# EAGLE design ALAYOUT (EAGLE 6.2)
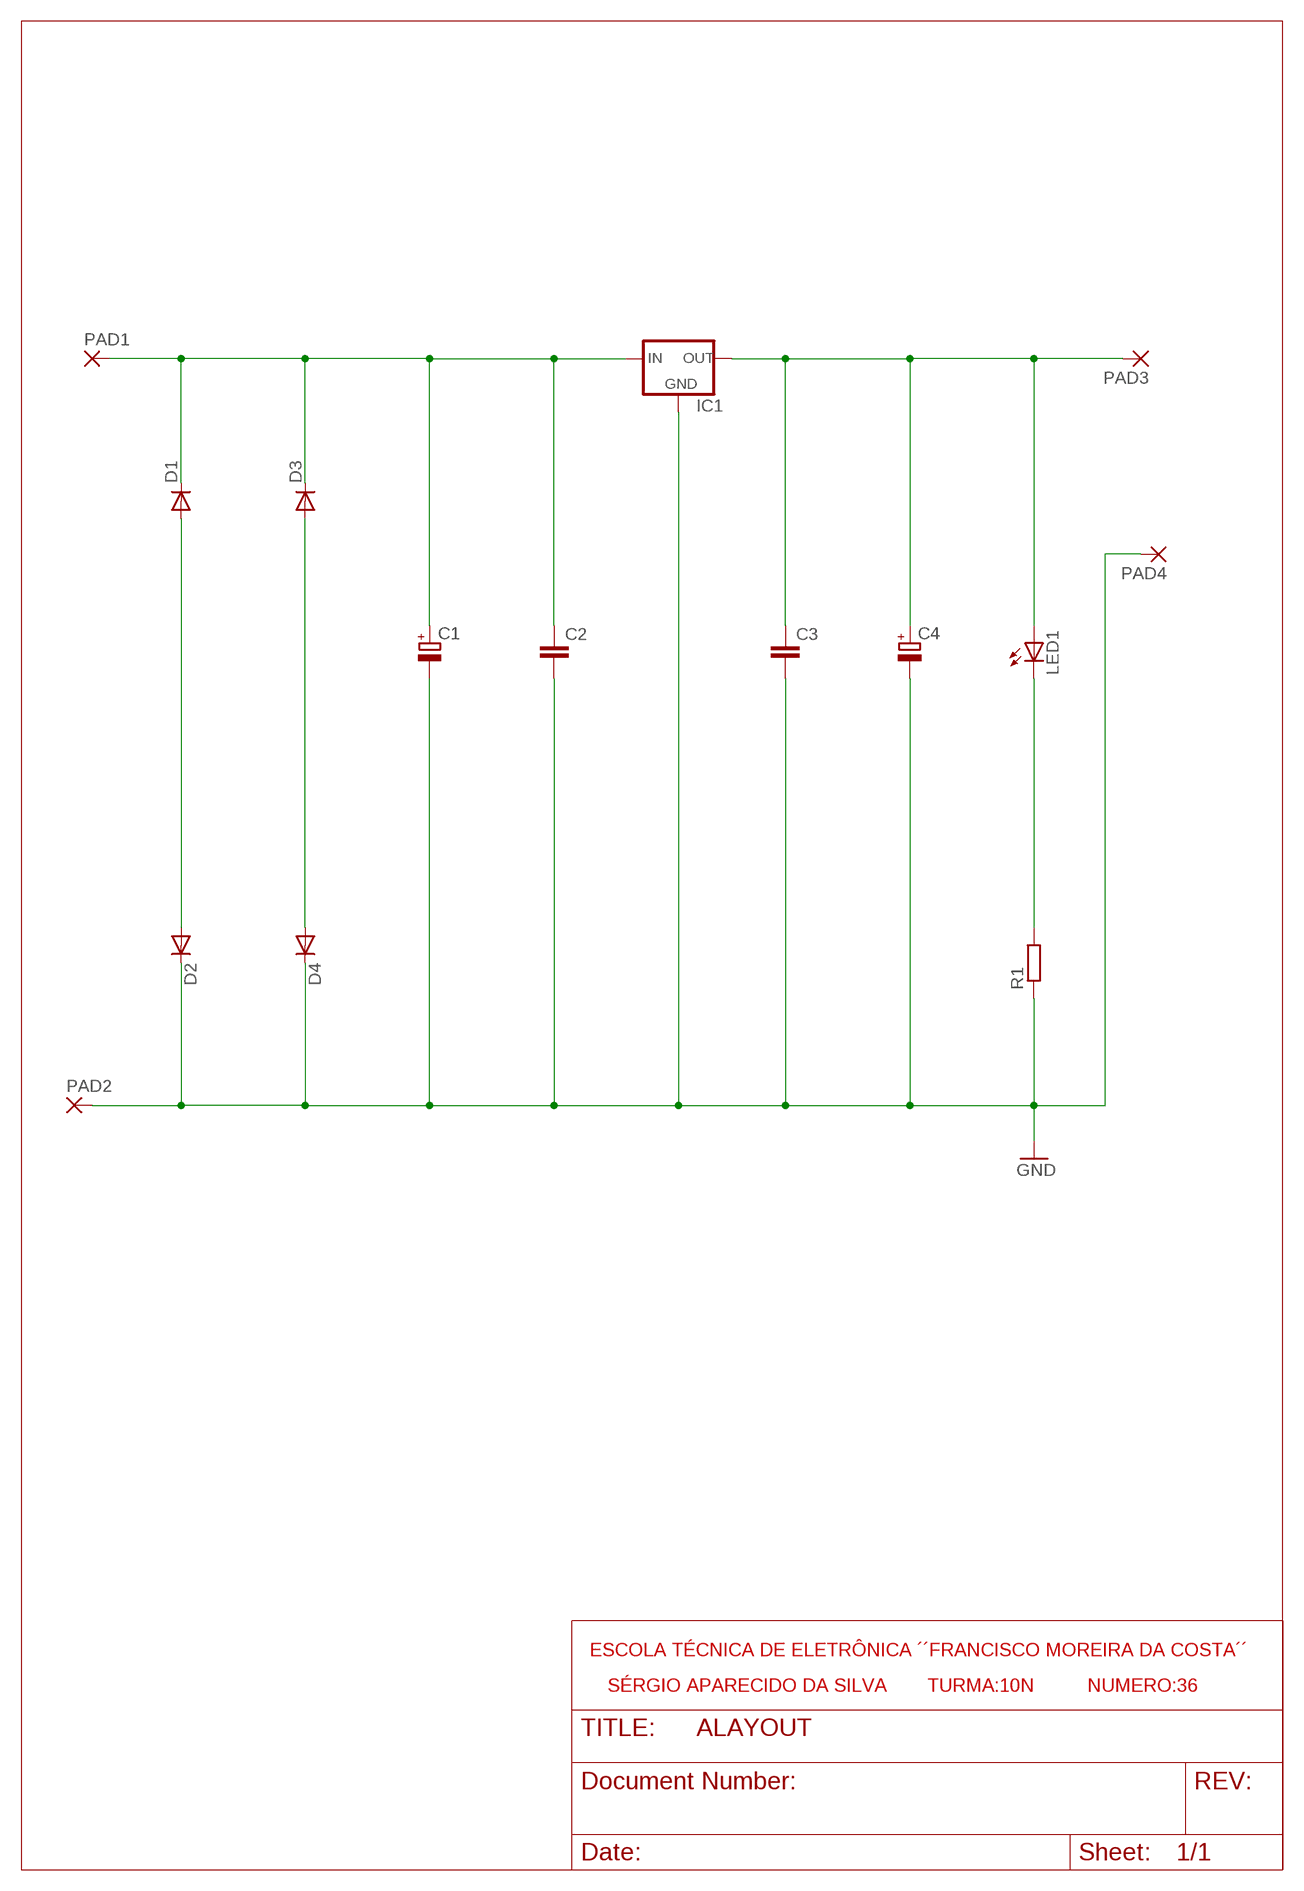
[diagram p0: schematic, sheet 1]

## Parts
C1  CPOL-EUE7.5-16  [E7,5-16]
C2  C-EU050-030X075  [C050-030X075]
C3  C-EU050-030X075  [C050-030X075]
C4  CPOL-EUE5-8.5  [E5-8,5]
D1  DIODE-DO35-10  [DO35-10]
D2  DIODE-DO35-10  [DO35-10]
D3  DIODE-DO35-10  [DO35-10]
D4  DIODE-DO35-10  [DO35-10]
IC1  78XXS  [78XXS]
LED1  LED3MM  [LED3MM]
PAD1  3,17/1,1  [3,17/1,1]
PAD2  3,17/1,1  [3,17/1,1]
PAD3  3,17/1,1  [3,17/1,1]
PAD4  3,17/1,1  [3,17/1,1]
R1  R-EU_0207/10  [0207/10]

## Nets
GND: C1.- C2.2 C3.2 C4.- D2.C D4.C IC1.GND PAD2.1(P) PAD4.1(P) R1.1
N$1: D3.A D4.A
N$2: C1.+ C2.1 D1.C D3.C IC1.IN PAD1.1(P)
N$3: D1.A D2.A
N$5: C3.1 C4.+ IC1.OUT LED1.A PAD3.1(P)
N$7: LED1.K(C) R1.2

## Notes on the sheet
- ESCOLA TÉCNICA DE ELETRÔNICA ´´FRANCISCO MOREIRA DA COSTA´´
- SÉRGIO APARECIDO DA SILVA | TURMA:10N | NUMERO:36

## Library data of the parts
C1 C4 = rcl:CPOL-EU: POLARIZED CAPACITOR, European symbol
C2 C3 = rcl:C-EU: CAPACITOR, European symbol
D1-D4 = diode:DIODE-: DIODE
IC1 = v-reg:78XXS: VOLTAGE REGULATOR
LED1 = led:LED: LED OSRAM: - CHIPLED LG R971, LG N971, LY N971, LG Q971, LY Q971, LO R971, LY R971 LH N974, LH R974 LS Q976, LO Q976, LY Q976 LO Q996 - Hyper CHIPLED LW Q18S LB Q993, LB Q99A, LB R99A - SideLED LS A670, LO A670, LY A670, LG A670, LP A670 LB A673, LV A673, LT A673, LW A673 LH A674 LY A675 LS A676, LA A676, LO A676, LY A676, LW A676 LS A679, LY A679, LG A679 - Hyper Micro SIDELED® LS Y876, LA Y876, LO Y876, LY Y876 LT Y87S - SmartLED LW L88C, LW L88S LB L89C, LB L89S, LG L890 LS L89K, LO L89K, LY L89K LS L896, LA L896, LO L896, LY L896 - TOPLED LS T670, LO T670, LY T670, LG T670, LP T670 LSG T670, LSP T670, LSY T670, LOP T670, LYG T670 LG T671, LOG T671, LSG T671 LB T673, LV T673, LT T673, LW T673 LH T674 LS T676, LA T676, LO T676, LY T676, LB T676, LH T676, LSB T676, LW T676 LB T67C, LV T67C, LT T67C, LS T67K, LO T67K, LY T67K, LW E67C LS E67B, LA E67B, LO E67B, LY E67B, LB E67C, LV E67C, LT E67C LW T67C LS T679, LY T679, LG T679 LS T770, LO T770, LY T770, LG T770, LP T770 LB T773, LV T773, LT T773, LW T773 LH T774 LS E675, LA E675, LY E675, LS T675 LS T776, LA T776, LO T776, LY T776, LB T776 LHGB T686 LT T68C, LB T68C - Hyper Mini TOPLED® LB M676 - Mini TOPLED Santana® LG M470 LS M47K, LO M47K, LY M47K Source: http://www.osram.convergy.de LUXEON: - LUMILED® LXK2-PW12-R00, LXK2-PW12-S00, LXK2-PW14-U00, LXK2-PW14-V00 LXK2-PM12-R00, LXK2-PM12-S00, LXK2-PM14-U00 LXK2-PE12-Q00, LXK2-PE12-R00, LXK2-PE12-S00, LXK2-PE14-T00, LXK2-PE14-U00 LXK2-PB12-K00, LXK2-PB12-L00, LXK2-PB12-M00, LXK2-PB14-N00, LXK2-PB14-P00, LXK2-PB14-Q00 LXK2-PR12-L00, LXK2-PR12-M00, LXK2-PR14-Q00, LXK2-PR14-R00 LXK2-PD12-Q00, LXK2-PD12-R00, LXK2-PD12-S00 LXK2-PH12-R00, LXK2-PH12-S00 LXK2-PL12-P00, LXK2-PL12-Q00, LXK2-PL12-R00 Source: www.luxeon.com KINGBRIGHT: KA-3528ASYC Source: www.kingbright.com
PAD1-PAD4 = wirepad:3,17/1,1: THROUGH-HOLE PAD
R1 = rcl:R-EU_: RESISTOR, European symbol

## Board
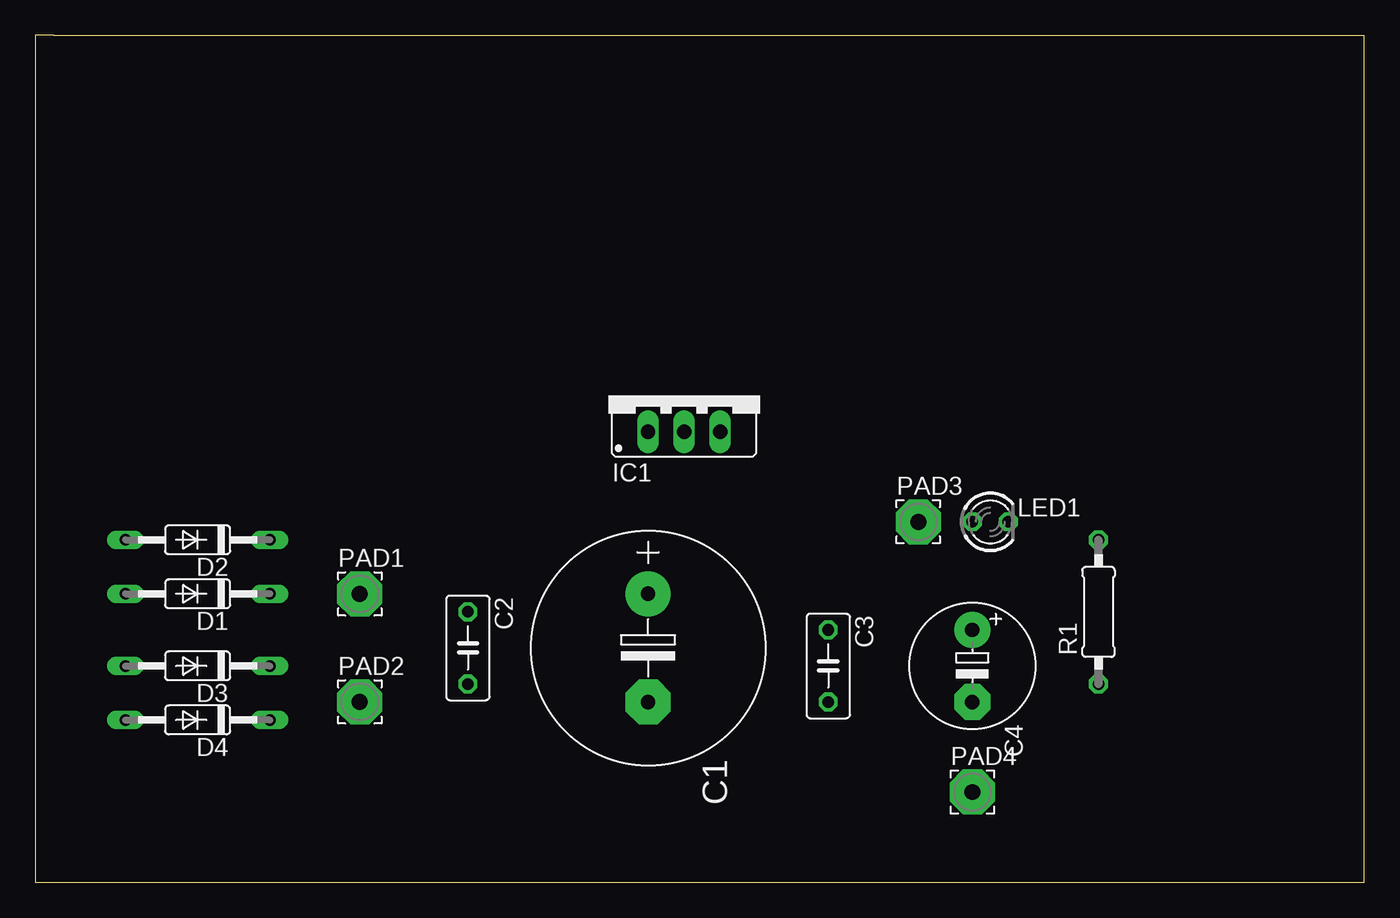
[diagram p1: board, top side]
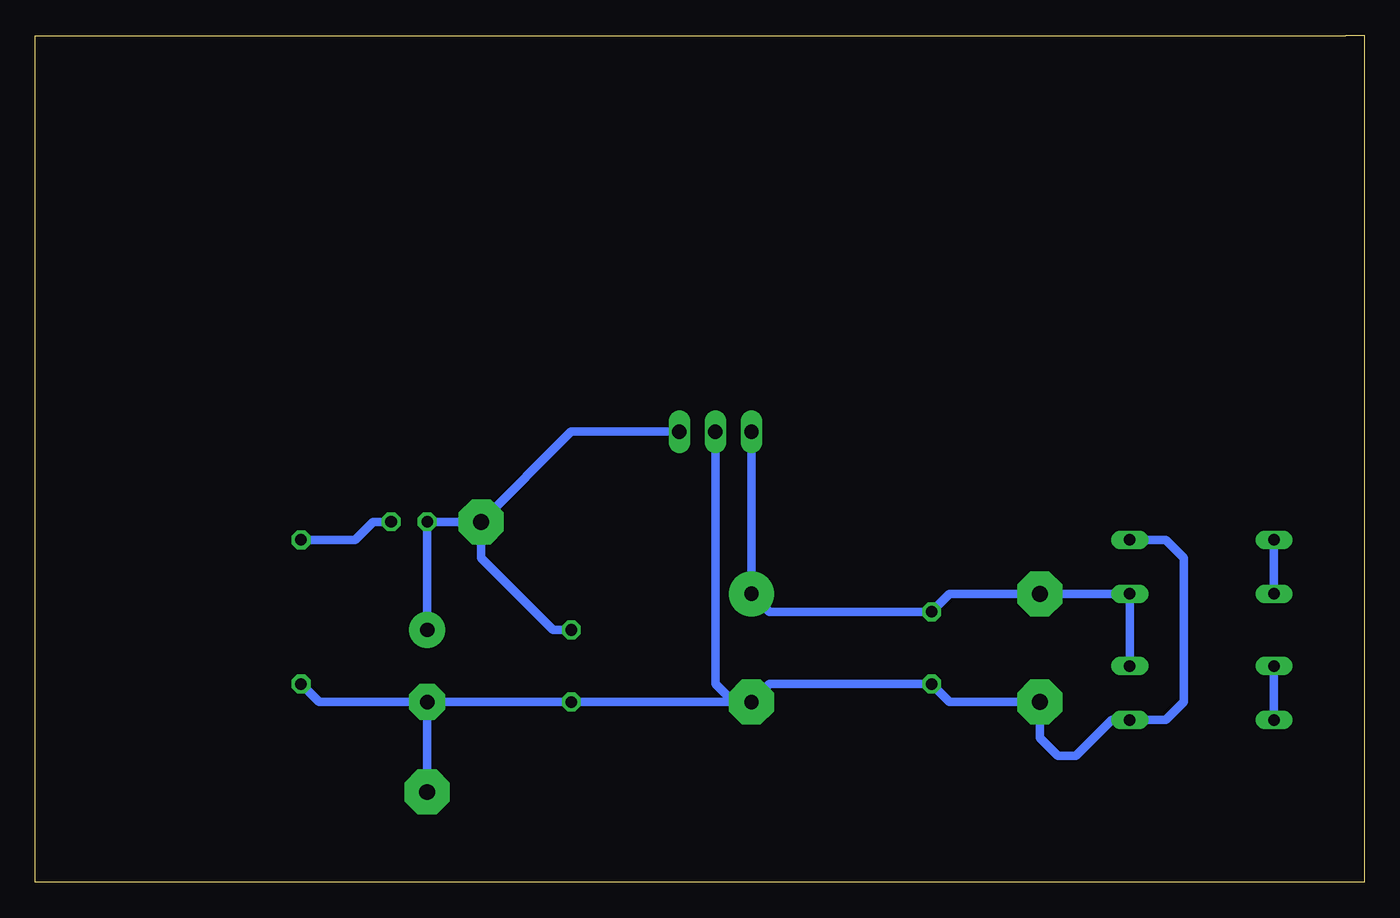
[diagram p2: board, bottom side, seen from below]

Size 93.65 x 59.69 mm. Coordinates in mm from the lower left corner, seen from the top.
Outline: 1.27,59.68 93.65,59.68 93.65,0 0,0 0,59.69 1.27,59.69
Copper layers (1*16): Top 0.035mm / dielectric 1.5mm / Bottom 0.035mm
Design rules: minimum track width 10mil, minimum drill 24mil, track to track 8mil, track to pad 8mil, pad to pad 8mil, via to via 8mil, smd to smd 8mil, copper to edge 40mil, drill to drill 8mil, minimum pad ring 10mil, minimum via ring 8mil, stop-mask expansion 4mil, vias tented up to drill 0mil, thermal gap 10mil

### Footprints (pad centres in the part's own frame; a part is rotated, then mirrored left to right if it is on the bottom)
E7,5-16 = drill 1.016 pad 3.15: + -3.81,0 | drill 1.016 pad 3.15 octagon: - 3.81,0
C050-030X075 = drill 0.813 octagon: 1 -2.54,0; 2 2.54,0
E5-8,5 = drill 1.016 pad 2.54: + -2.54,0 | drill 1.016 pad 2.54 octagon: - 2.54,0
DO35-10 = drill 0.813 long: A 5.08,0; C -5.08,0
78XXS = drill 1.016 long: GND 0,-2.54; IN -2.54,-2.54; OUT 2.54,-2.54
LED3MM = drill 0.813 octagon: A -1.27,0; K 1.27,0
3,17/1,1 = drill 1.118 pad 3.175 octagon: 1 0,0
0207/10 = drill 0.813 octagon: 1 -5.08,0; 2 5.08,0

### Placement (x,y rotation side)
C1  43.18,16.51 270 top
C2  30.48,16.51 270 top
C3  55.88,15.24 270 top
C4  66.04,15.24 270 top
D1  11.43,20.32 180 top
D2  11.43,24.13 180 top
D3  11.43,15.24 180 top
D4  11.43,11.43 180 top
IC1  45.72,34.29 0 top
LED1  67.31,25.4 0 top
PAD1  22.86,20.32 0 top
PAD2  22.86,12.7 0 top
PAD3  62.23,25.4 0 top
PAD4  66.04,6.35 0 top
R1  74.93,19.05 90 top

### Tracks (layer width: path | path; a pad name or v marks a point on that pad's centre or on a via)
GND
  Bottom 0.61: D2.C 13.97,24.13 12.7,22.86 12.7,12.7 13.97,11.43 D4.C 17.78,11.43 20.32,8.89 21.59,8.89 22.86,10.16 PAD2.1 29.21,12.7 C2.2 41.91,13.97 C1.- | IC1.GND 45.72,13.97 44.45,12.7 C1.- | C1.- C3.2 C4.- | C4.- PAD4.1 | C4.- 73.66,12.7 R1.1
N$1
  Bottom 0.61: D4.A D3.A
N$2
  Bottom 0.61: D3.C D1.C PAD1.1 29.21,20.32 C2.1 41.91,19.05 C1.+ IC1.IN
N$3
  Bottom 0.61: D2.A D1.A
N$5
  Bottom 0.61: IC1.OUT 55.88,31.75 PAD3.1 | C3.1 57.15,17.78 62.23,22.86 PAD3.1 | C4.+ LED1.A PAD3.1
N$7
  Bottom 0.61: R1.2 71.12,24.13 69.85,25.4 LED1.K